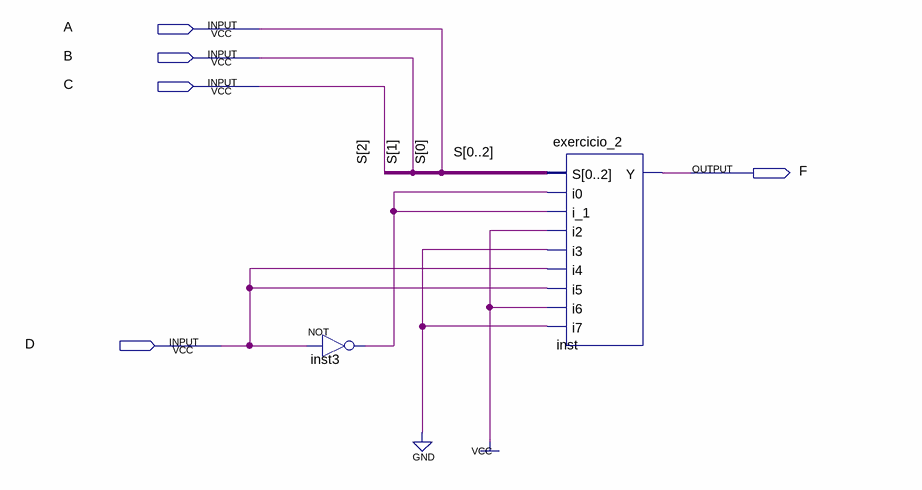
[diagram p0: schematic sheet]
// Quartus schematic Block3.bdf as structural Verilog: 2 symbols, 5 pins
module Block3 (
  input  A,
  input  B,
  input  C,
  input  D,
  output F
);

  wire inst3_out;

  not inst3 (inst3_out, D);
  exercicio_2 inst (
    .S({A, B, C}), .i0(inst3_out), .i_1(inst3_out), .i2(1'b1), .i3(1'b0), .i4(D), .i5(D), .i6(1'b1),
    .i7(1'b0), .Y(F));

  // Other names for the same wires on the sheet: S[2:0] = {C, B, A}
endmodule
